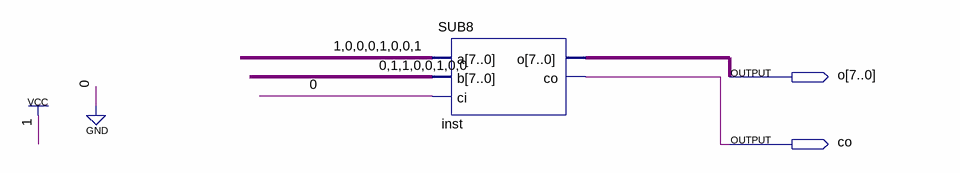
[diagram p0: schematic sheet]
// Quartus schematic SubTest.bdf as structural Verilog: 1 symbols, 2 pins
module SubTest (
  output [7:0] o,
  output co
);

  SUB8 inst (.a(8'b10001001), .b(8'b01100100), .ci(1'b0), .o(o), .co(co));
endmodule
